# Altium schematic sheet Output.SchDoc
size A4; SheetNumber: 7; SheetTotal: 7
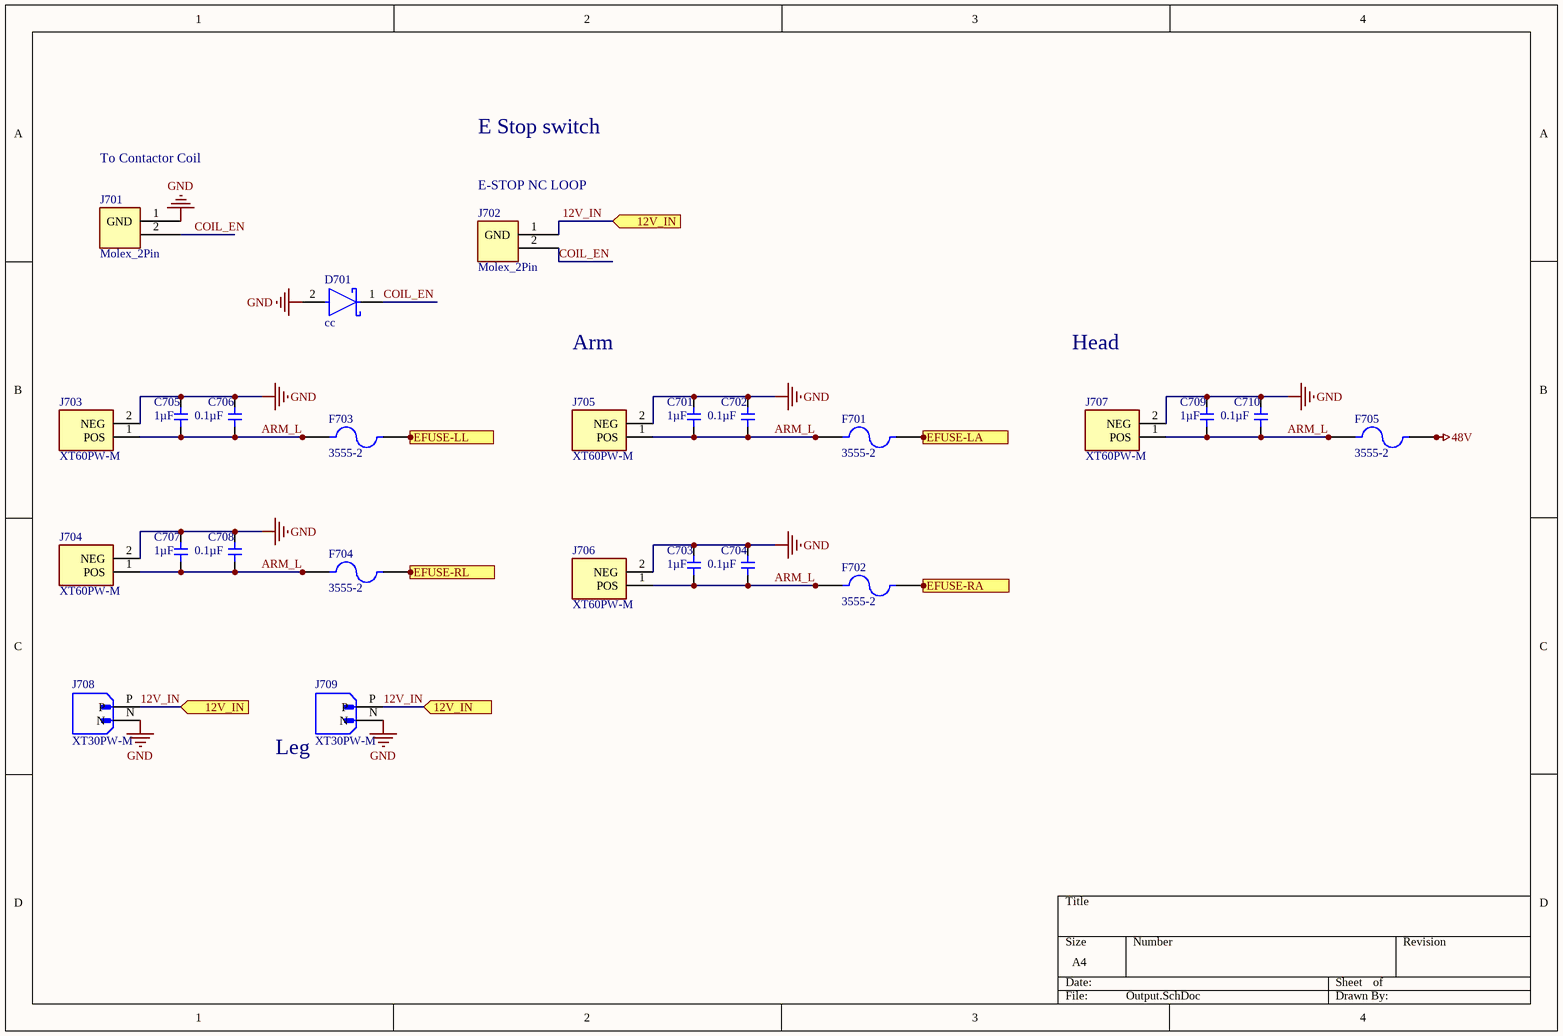
[diagram p0: Output.SchDoc]

## Parts
C701  Capacitance: 1µF  [0805]  (hidden comment: non-polar_Capacitor)
C702  Capacitance: 0.1µF  [0603]  (hidden comment: non-polar_Capacitor)
C703  Capacitance: 1µF  [0805]  (hidden comment: non-polar_Capacitor)
C704  Capacitance: 0.1µF  [0603]  (hidden comment: non-polar_Capacitor)
C705  Capacitance: 1µF  [0805]  (hidden comment: non-polar_Capacitor)
C706  Capacitance: 0.1µF  [0603]  (hidden comment: non-polar_Capacitor)
C707  Capacitance: 1µF  [0805]  (hidden comment: non-polar_Capacitor)
C708  Capacitance: 0.1µF  [0603]  (hidden comment: non-polar_Capacitor)
C709  Capacitance: 1µF  [0805]  (hidden comment: non-polar_Capacitor)
C710  Capacitance: 0.1µF  [0603]  (hidden comment: non-polar_Capacitor)
D701  cc  [FP-403A-03-MFG]
F701  3555-2  [FUSE_3555-2]
F702  3555-2  [FUSE_3555-2]
F703  3555-2  [FUSE_3555-2]
F704  3555-2  [FUSE_3555-2]
F705  3555-2  [FUSE_3555-2]
J701  Molex_2Pin  [MOLEX_2PIN]
J702  Molex_2Pin  [MOLEX_2PIN]
J703  XT60PW-M  [XT60PW-M]
J704  XT60PW-M  [XT60PW-M]
J705  XT60PW-M  [XT60PW-M]
J706  XT60PW-M  [XT60PW-M]
J707  XT60PW-M  [XT60PW-M]
J708  XT30PW-M  [AMASS_XT30PW-M]
J709  XT30PW-M  [AMASS_XT30PW-M]

## Ports
12V_IN (in), EFUSE-LA (in), EFUSE-LL (in), EFUSE-RA (in), EFUSE-RL (in)

## Nets
48V: F705.2_1 F705.2_2
GND: C701.2 C702.2 C703.2 C704.2 C705.2 C706.2 C707.2 C708.2 C709.2 C710.2 D701.2(A) J701.1(GND) J703.2(NEG) J704.2(NEG) J705.2(NEG) J706.2(NEG) J707.2(NEG) J708.N J709.N
12V_IN: J702.1(GND) J708.P J709.P ; port 12V_IN
ARM_L: C701.1 C702.1 C703.1 C704.1 C705.1 C706.1 C707.1 C708.1 C709.1 C710.1 F701.1_1 F701.1_2 F702.1_1 F702.1_2 F703.1_1 F703.1_2 F704.1_1 F704.1_2 F705.1_1 F705.1_2 J703.1(POS) J704.1(POS) J705.1(POS) J706.1(POS) J707.1(POS)
COIL_EN: D701.1(C) J701.2 J702.2
EFUSE-LA: F701.2_1 F701.2_2 ; port EFUSE-LA
EFUSE-LL: F703.2_1 F703.2_2 ; port EFUSE-LL
EFUSE-RA: F702.2_1 F702.2_2 ; port EFUSE-RA
EFUSE-RL: F704.2_1 F704.2_2 ; port EFUSE-RL

## Notes on the sheet
- To Contactor Coil
- E Stop switch
- (near J702) E-STOP NC LOOP
- Arm
- Head
- (near J709) Leg

## Library data of the parts
C701-C710 = CMP-024-000020-16: SMD type ceramic capacitor; Voltage: 100V; Source: robit_passive.SchLib; Design Item ID: Capacitor
D701 = CMP-026-000004-1: Rectifier Diode, Schottky, 1 Phase, 1 Element, 5A, 100V V(RRM), Silicon
F701-F705 = 3555-2: Auto Fuse Holder, 1 Fuse, Blade, Standard, THM, 50Amp, Hi-Temp Nylon, UL94V-0 | Keystone Electronics 3555-2; SnapEDA_Link: https://www.snapeda.com/parts/3555-2/Keystone/view-part/?ref=snap; Package: None; Value: *; MF: Keystone Electronics; MP: 3555-2; Check_prices: https://www.snapeda.com/parts/3555-2/Keystone/view-part/?ref=eda
J701 J702 = CMP-019-000043-2: Molex 2Pin Connector; Design Item ID: Molex_2Pin; System: Connector; Source: robit_connector.SchLib
J703-J707 = CMP-019-000059-2: Socket, DC supply, male, PIN: 2; System: Connector; MF: AMASS; Value: *; MP: XT60PW-M; SnapEDA_Link: https://www.snapeda.com/parts/XT60PW-M/AMASS/view-part/?ref=snap; Check_prices: https://www.snapeda.com/parts/XT60PW-M/AMASS/view-part/?ref=eda; Price: None; Source: robit_connector.SchLib; Package: Package; Availability: Not in stock; Design Item ID: XT60PW-M
J708 J709 = CMP-019-000079-2: Socket; DC supply; XT30; male; PIN: 2; on PCBs; THT; Colour: yellow; System: Connector; MF: AMASS; Check_prices: https://www.snapeda.com/parts/XT30PW-M/AMASS/view-part/?ref=eda; Source: XT30PW-M.SchLib; Pin Count: 2; Value: *; Package: None; Component Type: Standard; SnapEDA_Link: https://www.snapeda.com/parts/XT30PW-M/AMASS/view-part/?ref=snap; MP: XT30PW-M; Design Item ID: XT30PW-M